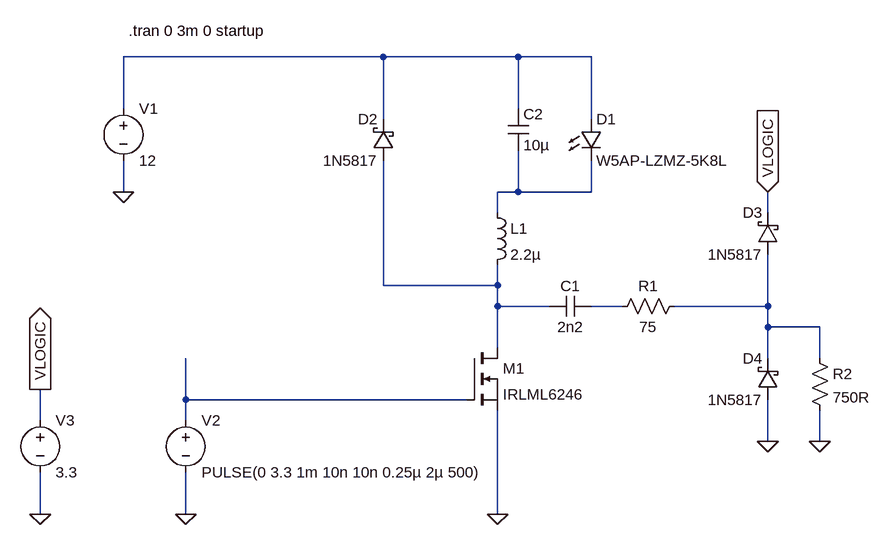
[diagram p0: schematic timings.asc]
timings.asc, the LTspice schematic file:
Version 4
SHEET 1 1144 724
WIRE 384 0 -16 0
WIRE 592 0 384 0
WIRE 704 0 592 0
WIRE -16 80 -16 0
WIRE 592 80 592 0
WIRE 384 96 384 0
WIRE 704 96 704 0
WIRE -16 208 -16 160
WIRE 592 208 592 144
WIRE 592 208 560 208
WIRE 704 208 704 160
WIRE 704 208 592 208
WIRE 560 240 560 208
WIRE 976 240 976 208
WIRE 384 352 384 160
WIRE 560 352 560 320
WIRE 560 352 384 352
WIRE 560 384 560 352
WIRE 640 384 560 384
WIRE 752 384 704 384
WIRE 976 384 976 304
WIRE 976 384 832 384
WIRE 976 416 976 384
WIRE 1056 416 976 416
WIRE 560 448 560 384
WIRE 976 464 976 416
WIRE 1056 464 1056 416
WIRE 80 528 80 464
WIRE 512 528 80 528
WIRE -144 560 -144 512
WIRE 80 560 80 528
WIRE 976 592 976 528
WIRE 1056 592 1056 544
WIRE -144 704 -144 640
WIRE 80 704 80 640
WIRE 560 704 560 544
FLAG 560 704 0
FLAG 80 704 0
FLAG 976 592 0
FLAG 976 208 VLOGIC
IOPIN 976 208 In
FLAG -16 208 0
FLAG -144 704 0
FLAG -144 512 VLOGIC
IOPIN -144 512 Out
FLAG 1056 592 0
SYMBOL voltage -16 64 R0
WINDOW 123 0 0 Left 2
WINDOW 39 0 0 Left 2
SYMATTR InstName V1
SYMATTR Value 12
SYMBOL cap 704 368 R90
WINDOW 0 0 32 VBottom 2
WINDOW 3 32 32 VTop 2
SYMATTR InstName C1
SYMATTR Value 2n2
SYMBOL res 848 368 R90
WINDOW 0 0 56 VBottom 2
WINDOW 3 32 56 VTop 2
SYMATTR InstName R1
SYMATTR Value 75
SYMBOL LED 688 96 R0
SYMATTR InstName D1
SYMATTR Value W5AP-LZMZ-5K8L
SYMBOL cap 576 80 R0
SYMATTR InstName C2
SYMATTR Value 10µ
SYMBOL schottky 400 160 R180
WINDOW 0 24 64 Left 2
WINDOW 3 24 0 Left 2
SYMATTR InstName D2
SYMATTR Value 1N5817
SYMATTR Description Diode
SYMATTR Type diode
SYMBOL ind 544 224 R0
SYMATTR InstName L1
SYMATTR Value 2.2µ
SYMBOL nmos 512 448 R0
SYMATTR InstName M1
SYMATTR Value IRLML6246
SYMBOL voltage 80 544 R0
WINDOW 123 0 0 Left 2
WINDOW 39 0 0 Left 2
SYMATTR InstName V2
SYMATTR Value PULSE(0 3.3 1m 10n 10n 0.25µ 2µ 500)
SYMBOL schottky 992 304 R180
WINDOW 0 24 64 Left 2
WINDOW 3 24 0 Left 2
SYMATTR InstName D3
SYMATTR Value 1N5817
SYMATTR Description Diode
SYMATTR Type diode
SYMBOL schottky 992 528 R180
WINDOW 0 24 64 Left 2
WINDOW 3 24 0 Left 2
SYMATTR InstName D4
SYMATTR Value 1N5817
SYMATTR Description Diode
SYMATTR Type diode
SYMBOL voltage -144 544 R0
WINDOW 123 0 0 Left 2
WINDOW 39 0 0 Left 2
SYMATTR InstName V3
SYMATTR Value 3.3
SYMBOL res 1040 448 R0
SYMATTR InstName R2
SYMATTR Value 750R
TEXT -8 -40 Left 2 !.tran 0 3m 0 startup

The netlist it stands for:
* timings.asc
V1 N001 0 12
C1 N004 N003 2n2
R1 N005 N004 75
D1 N001 N002 W5AP-LZMZ-5K8L
C2 N001 N002 10µ
D2 N003 N001 1N5817
L1 N002 N003 2.2µ
M1 N003 N006 0 0 IRLML6246
V2 N006 0 PULSE(0 3.3 1m 10n 10n 0.25µ 2µ 500)
D3 N005 VLOGIC 1N5817
D4 0 N005 1N5817
V3 VLOGIC 0 3.3
R2 N005 0 750R
.model D D
.lib standard.dio
.model NMOS NMOS
.model PMOS PMOS
.lib standard.mos
.tran 0 3m 0 startup
.backanno
.end